# EAGLE design motor_board (EAGLE 7.7.0)
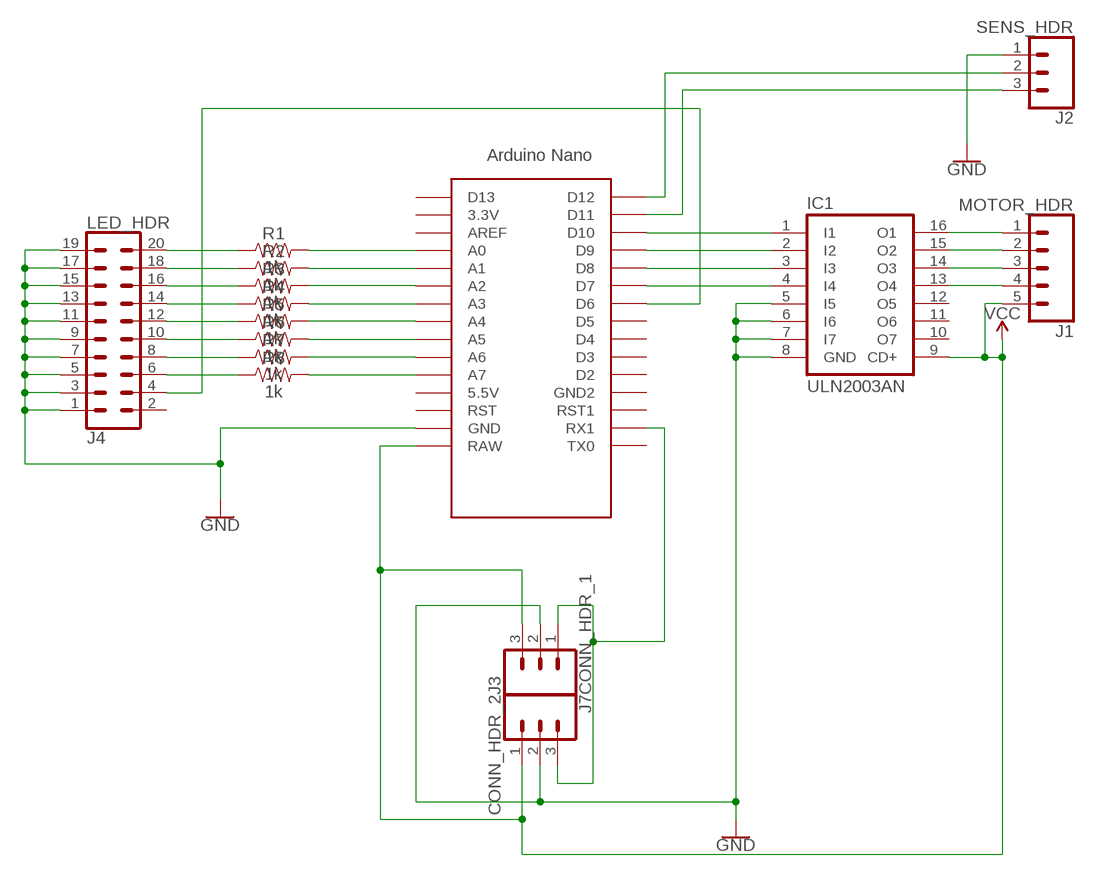
[diagram p0: schematic, sheet 1]

## Parts
IC1  ULN2003AN  [DIL16]
J1  MOTOR_HDR  CONN_05  [1X05]
J2  SENS_HDR  CONN_03  [1X03]
J3  CONN_HDR_1  CONN_03  [1X03]
J4  LED_HDR  CONN_10X2  [2X10]
J7  CONN_HDR_2  CONN_03  [1X03]
R1  1k  1KOHM-HORIZ-1/4W-1%  [AXIAL-0.3]
R2  1k  1KOHM-HORIZ-1/4W-1%  [AXIAL-0.3]
R3  1k  1KOHM-HORIZ-1/4W-1%  [AXIAL-0.3]
R4  1k  1KOHM-HORIZ-1/4W-1%  [AXIAL-0.3]
R5  1k  1KOHM-HORIZ-1/4W-1%  [AXIAL-0.3]
R6  1k  1KOHM-HORIZ-1/4W-1%  [AXIAL-0.3]
R7  1k  1KOHM-HORIZ-1/4W-1%  [AXIAL-0.3]
R8  1k  1KOHM-HORIZ-1/4W-1%  [AXIAL-0.3]
U$1  NANO  [NANO]

## Nets
DOWN_DET: J2.3 U$1.D11
GND: IC1.5(I5) IC1.6(I6) IC1.7(I7) IC1.8(GND) J2.1 J3.2 J4.1 J4.3 J4.5 J4.7 J4.9 J4.11 J4.13 J4.15 J4.17 J4.19 J7.2 U$1.GND
LED1: R1.P$2 U$1.A0
LED2: R2.P$2 U$1.A1
LED3: R3.P$2 U$1.A2
LED4: R4.P$2 U$1.A3
LED5: R5.P$2 U$1.A4
LED6: R6.P$2 U$1.A5
LED7: R7.P$2 U$1.A6
LED8: R8.P$2 U$1.A7
N$1: IC1.1(I1) U$1.D10
N$2: IC1.2(I2) U$1.D9
N$3: IC1.3(I3) U$1.D8
N$4: IC1.4(I4) U$1.D7
N$5: IC1.16(O1) J1.1
N$6: IC1.15(O2) J1.2
N$7: IC1.14(O3) J1.3
N$8: IC1.13(O4) J1.4
N$9: J4.20 R1.P$1
N$10: J4.18 R2.P$1
N$11: J4.16 R3.P$1
N$13: J4.14 R4.P$1
N$14: J4.4 U$1.D6
N$15: J4.12 R5.P$1
N$16: J4.10 R6.P$1
N$17: J4.8 R7.P$1
N$18: J4.6 R8.P$1
RX: J3.1 J7.3 U$1.RX1
UP_DET: J2.2 U$1.D12
VCC: IC1.9(CD+) J1.5 J3.3 J7.1 U$1.RAW
Unconnected: IC1.10(O7) IC1.11(O6) IC1.12(O5) J4.2 U$1.3.3V U$1.5V(5.5V) U$1.AREF U$1.D2 U$1.D3 U$1.D4 U$1.D5 U$1.D13 U$1.GND1(GND2) U$1.ICSP1 U$1.ICSP2 U$1.ICSP3 U$1.ICSP4 U$1.ICSP5 U$1.ICSP6 U$1.RST U$1.RST1 U$1.TX0

## Library data of the parts
IC1 = uln-udn:ULN2003A: DRIVER ARRAY
J1 = SparkFun-Connectors:CONN_05: Multi connection point. Often used as Generic Header-pin footprint for 0.1 inch spaced/style header connections On any of the 0.1 inch spaced packages, you can populate with these: Break Away Headers - Straight <https://www.sparkfun.com/products/116> (PRT-00116) Break Away Male Headers - Right Angle <https://www.sparkfun.com/products/553> (PRT-00553) Female Headers <https://www.sparkfun.com/products/115> (PRT-00115) Break Away Headers - Machine Pin <https://www.sparkfun.com/products/117> (PRT-00117) Break Away Female Headers - Swiss Machine Pin <https://www.sparkfun.com/products/743> (PRT-00743) For SCREWTERMINALS and SPRING TERMINALS visit here: Screw Terimnals on SparkFun.com <https://www.sparkfun.com/search/results?term=Screw+Terminals> (5mm/3.5mm/2.54mm spacing) This device is also useful as a general connection point to wire up your design to another part of your project. Our various solder wires solder well into these plated through hole pads. Hook-Up Wire - Assortment (Stranded, 22 AWG) <https://www.sparkfun.com/products/11375> (PRT-11375) Hook-Up Wire - Assortment (Solid Core, 22 AWG) <https://www.sparkfun.com/products/11367> (PRT-11367) View the entire wire category on our website here <https://www.sparkfun.com/categories/141> Special notes: Molex polarized connector foot print use with SKU : PRT-08231 with associated crimp pins and housings. 1MM SMD Version SKU: PRT-10208
J2 J3 J7 = SparkFun-Connectors:CONN_03: Multi connection point. Often used as Generic Header-pin footprint for 0.1 inch spaced/style header connections On any of the 0.1 inch spaced packages, you can populate with these: Break Away Headers - Straight <https://www.sparkfun.com/products/116> (PRT-00116) Break Away Male Headers - Right Angle <https://www.sparkfun.com/products/553> (PRT-00553) Female Headers <https://www.sparkfun.com/products/115> (PRT-00115) Break Away Headers - Machine Pin <https://www.sparkfun.com/products/117> (PRT-00117) Break Away Female Headers - Swiss Machine Pin <https://www.sparkfun.com/products/743> (PRT-00743) Stackable Header - 3 Pin (Female, 0.1") <https://www.sparkfun.com/products/13875> (PRT-13875) For SCREWTERMINALS and SPRING TERMINALS visit here: Screw Terimnals on SparkFun.com <https://www.sparkfun.com/search/results?term=Screw+Terminals> (5mm/3.5mm/2.54mm spacing) This device is also useful as a general connection point to wire up your design to another part of your project. Our various solder wires solder well into these plated through hole pads. Hook-Up Wire - Assortment (Stranded, 22 AWG) <https://www.sparkfun.com/products/11375> (PRT-11375) Hook-Up Wire - Assortment (Solid Core, 22 AWG) <https://www.sparkfun.com/products/11367> (PRT-11367) View the entire wire category on our website here <https://www.sparkfun.com/categories/141> Special notes: Molex polarized connector foot print use with SKU : PRT-08232 with associated crimp pins and housings.
J4 = SparkFun-Connectors:CONN_10X2: Multi connection point. Often used as Generic Header-pin footprint for 0.1 inch spaced/style header connections On any of the 0.1 inch spaced packages, you can populate with these: Break Away Headers - Straight <https://www.sparkfun.com/products/116> (PRT-00116) Break Away Male Headers - Right Angle <https://www.sparkfun.com/products/553> (PRT-00553) Female Headers <https://www.sparkfun.com/products/115> (PRT-00115) Break Away Headers - Machine Pin <https://www.sparkfun.com/products/117> (PRT-00117) Break Away Female Headers - Swiss Machine Pin <https://www.sparkfun.com/products/743> (PRT-00743) Special note about the "SPECIAL" package: This was SPECIALLY designed to be used with our Graphic LCD Backpack. Be sure you want to use this! It is not only staggered on each line of header holes, but IT IS ALSO offset of the center point of the top and bottom lines by 5 mil. This causes the headers to lock into place on the "standard" footprint on the LCD screen. The extra squares on the tdocu layer are there simply to reference other pins (if you were to actually populate a longer header than ten long - this is what we do with the backpacks).
R1-R8 = SparkFun-Resistors:1KOHM: 1kΩ resistor A resistor is a passive two-terminal electrical component that implements electrical resistance as a circuit element. Resistors act to reduce current flow, and, at the same time, act to lower voltage levels within circuits. - Wikipedia; PROD_ID: RES-12182
U$1 = Arduino-clone:NANO: Arduino Nano

## Board
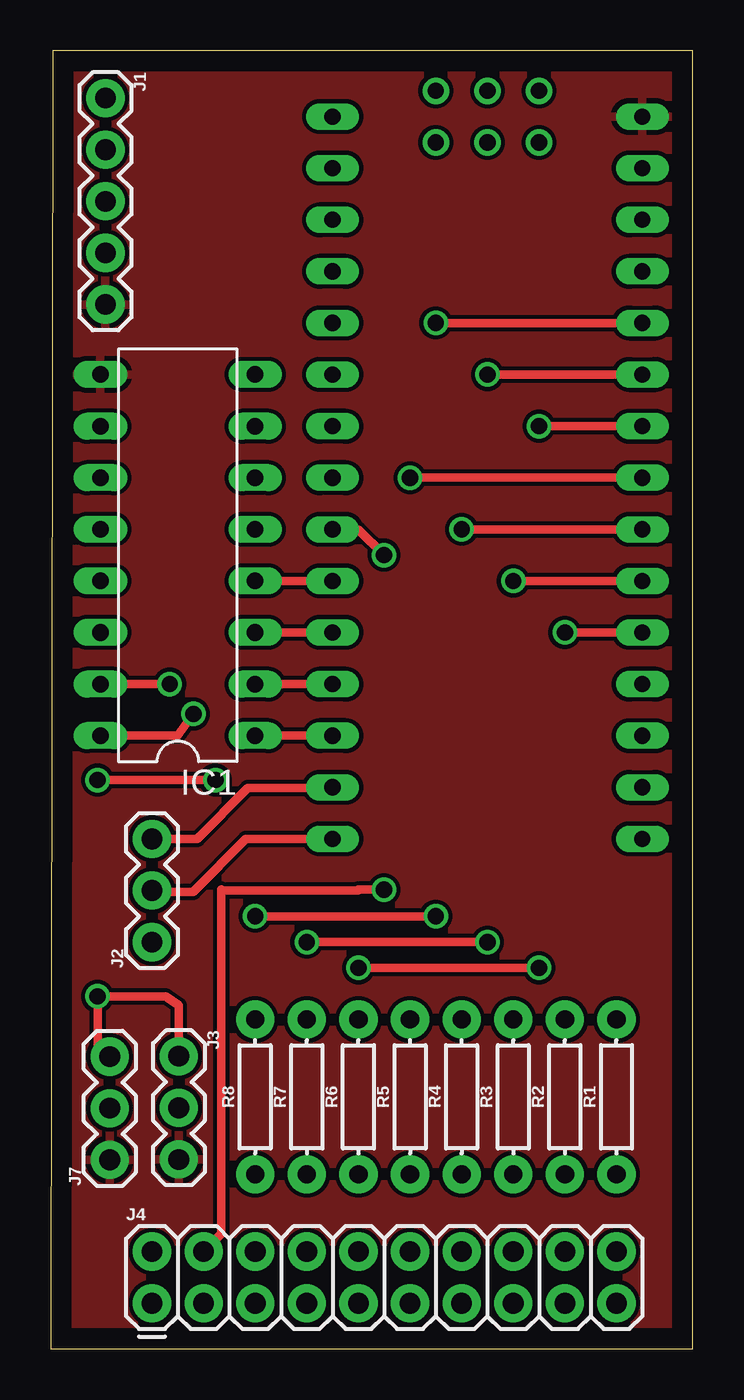
[diagram p1: board, top side]
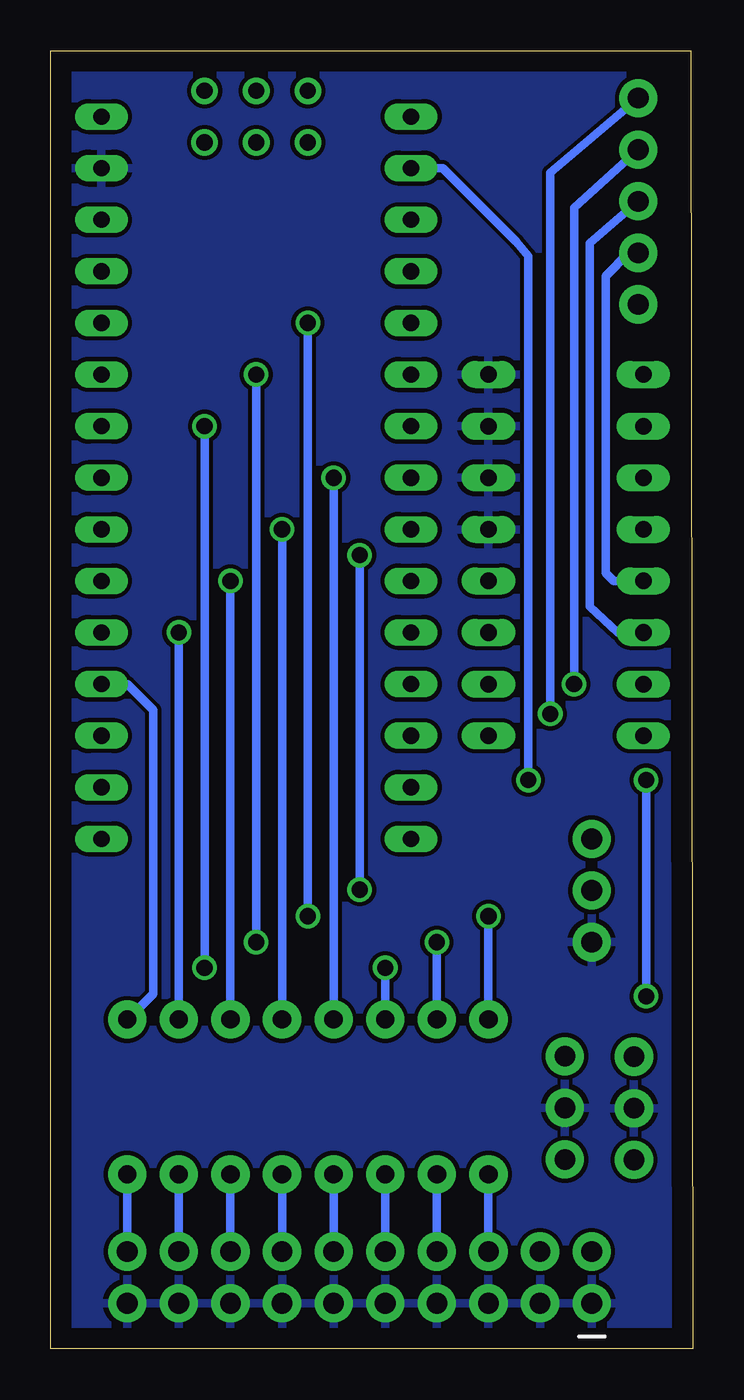
[diagram p2: board, bottom side, seen from below]

Size 31.6 x 63.9 mm. Coordinates in mm from the lower left corner, seen from the top.
Outline: 0,0 31.6,0 31.6,63.9 0.1,63.9 0,0
Copper layers (1*16): Top 0.035mm / dielectric 1.5mm / Bottom 0.035mm
Design rules "default": minimum track width 10mil, minimum drill 24mil, track to track 8mil, track to pad 8mil, pad to pad 8mil, via to via 8mil, smd to smd 8mil, copper to edge 40mil, drill to drill 8mil, minimum pad ring 10mil, minimum via ring 8mil, stop-mask expansion 4mil, vias tented up to drill 0mil, thermal gap 10mil

### Footprints (pad centres in the part's own frame; a part is rotated, then mirrored left to right if it is on the bottom)
DIL16 = drill 0.813 long: 1 -8.89,-3.81; 2 -6.35,-3.81; 3 -3.81,-3.81; 4 -1.27,-3.81; 5 1.27,-3.81; 6 3.81,-3.81; 7 6.35,-3.81; 8 8.89,-3.81; 9 8.89,3.81; 10 6.35,3.81; 11 3.81,3.81; 12 1.27,3.81; 13 -1.27,3.81; 14 -3.81,3.81; 15 -6.35,3.81; 16 -8.89,3.81
1X05 = drill 1.016 pad 1.88: 1 0,0; 2 2.54,0; 3 5.08,0; 4 7.62,0; 5 10.16,0
1X03 = drill 1.016 pad 1.88: 1 0,0; 2 2.54,0; 3 5.08,0
2X10 = drill 1.016 pad 1.88: 1 0,0; 2 0,2.54; 3 2.54,0; 4 2.54,2.54; 5 5.08,0; 6 5.08,2.54; 7 7.62,0; 8 7.62,2.54; 9 10.16,0; 10 10.16,2.54; 11 12.7,0; 12 12.7,2.54; 13 15.24,0; 14 15.24,2.54; 15 17.78,0; 16 17.78,2.54; 17 20.32,0; 18 20.32,2.54; 19 22.86,0; 20 22.86,2.54
AXIAL-0.3 = drill 0.9 pad 1.88: P$1 -3.81,0; P$2 3.81,0
NANO = drill 0.8 long: 3.3V -10.16,24.13; 5V -10.16,-1.27; A0 -10.16,19.05; A1 -10.16,16.51; A2 -10.16,13.97; A3 -10.16,11.43; A4 -10.16,8.89; A5 -10.16,6.35; A6 -10.16,3.81; A7 -10.16,1.27; AREF -10.16,21.59; D2 5.08,1.27; D3 5.08,3.81; D4 5.08,6.35; D5 5.08,8.89; D6 5.08,11.43; D7 5.08,13.97; D8 5.08,16.51; D9 5.08,19.05; D10 5.08,21.59; D11 5.08,24.13; D12 5.08,26.67; D13 -10.16,26.67; GND -10.16,-6.35; GND1 5.08,-1.27; RAW -10.16,-8.89; RST -10.16,-3.81; RST1 5.08,-3.81; RX1 5.08,-6.35; TX0 5.08,-8.89 | drill 0.8: ICSP1 -5.08,-10.16; ICSP2 -5.08,-7.62; ICSP3 -2.54,-10.16; ICSP4 -2.54,-7.62; ICSP5 0,-10.16; ICSP6 0,-7.62

### Placement (x,y rotation side)
IC1  6.25,39.07 90 top
J1  2.69,61.57 270 top
J2  4.98,20.02 90 top
J3  6.3,14.4 270 top
J4  4.98,2.24 0 top
J7  2.9,9.3 90 top
R1  27.84,12.4 90 top
R2  25.3,12.4 90 top
R3  22.76,12.4 90 top
R4  20.22,12.4 90 top
R5  17.68,12.4 90 top
R6  15.14,12.4 90 top
R7  12.6,12.4 90 top
R8  10.06,12.4 90 top
U$1  18.95,51.77 180 top

### Tracks (layer width: path | path; a pad name or v marks a point on that pad's centre or on a via)
DOWN_DET
  Top 0.406: J2.3 7.2,25.1 9.7,27.6 13.83,27.6 U$1.D11
GND
  pour Bottom: 0.1,63.6 31.5,63.6 31.5,-0.1 0.2,-0.1
LED1
  Bottom 0.406: U$1.A0 27.84,32.72 26.57,31.45 26.57,17.48 R1.P$2
LED2  (via drill 0.8)
  Top 0.406: v25.3,35.26 U$1.A1
  Bottom 0.406: R2.P$2 v25.3,35.26
LED3  (via drill 0.8)
  Top 0.406: v22.76,37.8 U$1.A2
  Bottom 0.406: R3.P$2 v22.76,37.8
LED4  (via drill 0.8)
  Top 0.406: U$1.A3 v20.22,40.34
  Bottom 0.406: R4.P$2 v20.22,40.34
LED5  (via drill 0.8)
  Top 0.406: v17.68,42.88 U$1.A4
  Bottom 0.406: R5.P$2 v17.68,42.88
LED6  (via drill 0.8)
  Top 0.406: v15.14,18.75 v24.03,18.75 | v24.03,45.42 U$1.A5
  Bottom 0.406: R6.P$2 v15.14,18.75 | v24.03,18.75 v24.03,45.42
LED7  (via drill 0.8)
  Top 0.406: v12.6,20.02 v21.49,20.02 | v21.49,47.96 U$1.A6
  Bottom 0.406: R7.P$2 v12.6,20.02 | v21.49,20.02 v21.49,47.96
LED8  (via drill 0.8)
  Top 0.406: U$1.A7 v18.95,50.5 | v18.95,21.29 v10.06,21.29
  Bottom 0.406: v18.95,50.5 v18.95,21.29 | v10.06,21.29 R8.P$2
N$1
  Top 0.406: U$1.D10 IC1.1
N$2
  Top 0.406: IC1.2 U$1.D9
N$3
  Top 0.406: U$1.D8 IC1.3
N$4
  Top 0.406: IC1.4 U$1.D7
N$5  (via drill 0.8)
  Top 0.406: IC1.16 6.25,30.18 v7.02,31.25
  Bottom 0.406: v7.02,31.25 7.02,57.9 J1.1
N$6  (via drill 0.8)
  Top 0.406: IC1.15 v5.85,32.72
  Bottom 0.406: v5.85,32.72 5.85,56.17 J1.2
N$7
  Bottom 0.406: IC1.14 3.71,35.26 5.08,36.53 5.08,54.44 J1.3
N$8
  Bottom 0.406: J1.4 3.15,53.95 4.3,52.8 4.3,38.2 3.9,37.8 IC1.13
N$9
  Bottom 0.406: R1.P$1 J4.20
N$10
  Bottom 0.406: R2.P$1 J4.18
N$11
  Bottom 0.406: J4.16 R3.P$1
N$13
  Bottom 0.406: R4.P$1 J4.14
N$14  (via drill 0.8)
  Top 0.406: U$1.D6 15.14,40.34 v16.41,39.07 v16.4,39.07 | J4.4 8.4,5.66 8.4,22.6 8.44,22.56 15.14,22.56 15.14,22.6 v16.4,22.6
  Bottom 0.406: v16.4,39.07 v16.4,22.6
N$15
  Bottom 0.406: J4.12 R5.P$1
N$16
  Bottom 0.406: R6.P$1 J4.10
N$17
  Bottom 0.406: J4.8 R7.P$1
N$18
  Bottom 0.406: R8.P$1 J4.6
RX  (via drill 0.8)
  Top 0.406: v8.1,28 v2.3,28 | J3.1 6.3,16.9 5.65,17.35 v2.3,17.35 2.3,14.98 J7.3
  Bottom 0.406: U$1.RX1 12.32,58.12 8.7,54.5 8.1,53.8 v8.1,28 | v2.3,28 v2.3,17.35
UP_DET
  Top 0.406: U$1.D12 9.6,25.1 7,22.5 5.04,22.5 J2.2
VCC
  pour Top: 0.1,63.7 31.5,63.7 31.5,0 0.1,0